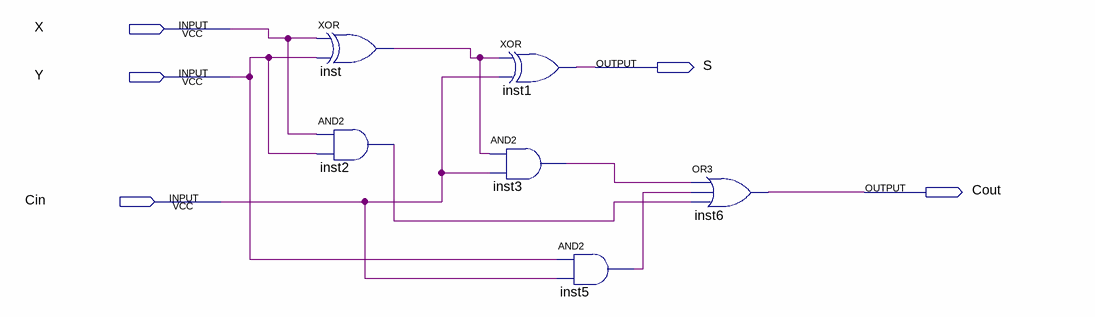
[diagram p0: schematic sheet]
// Quartus schematic lab7.bdf as structural Verilog: 6 symbols, 5 pins
module lab7 (
  input  X,
  input  Y,
  input  Cin,
  output S,
  output Cout
);

  wire inst2_out, inst3_out, inst5_out, inst_out;

  xor inst (inst_out, X, Y);
  and inst2 (inst2_out, X, Y);
  xor inst1 (S, inst_out, Cin);
  and inst3 (inst3_out, inst_out, Cin);
  and inst5 (inst5_out, Y, Cin);
  or inst6 (Cout, inst3_out, inst5_out, inst2_out);
endmodule
